# EAGLE design Cargador_RasPi3HAT_CamSlot_v1.0 (EAGLE 9.3.0)
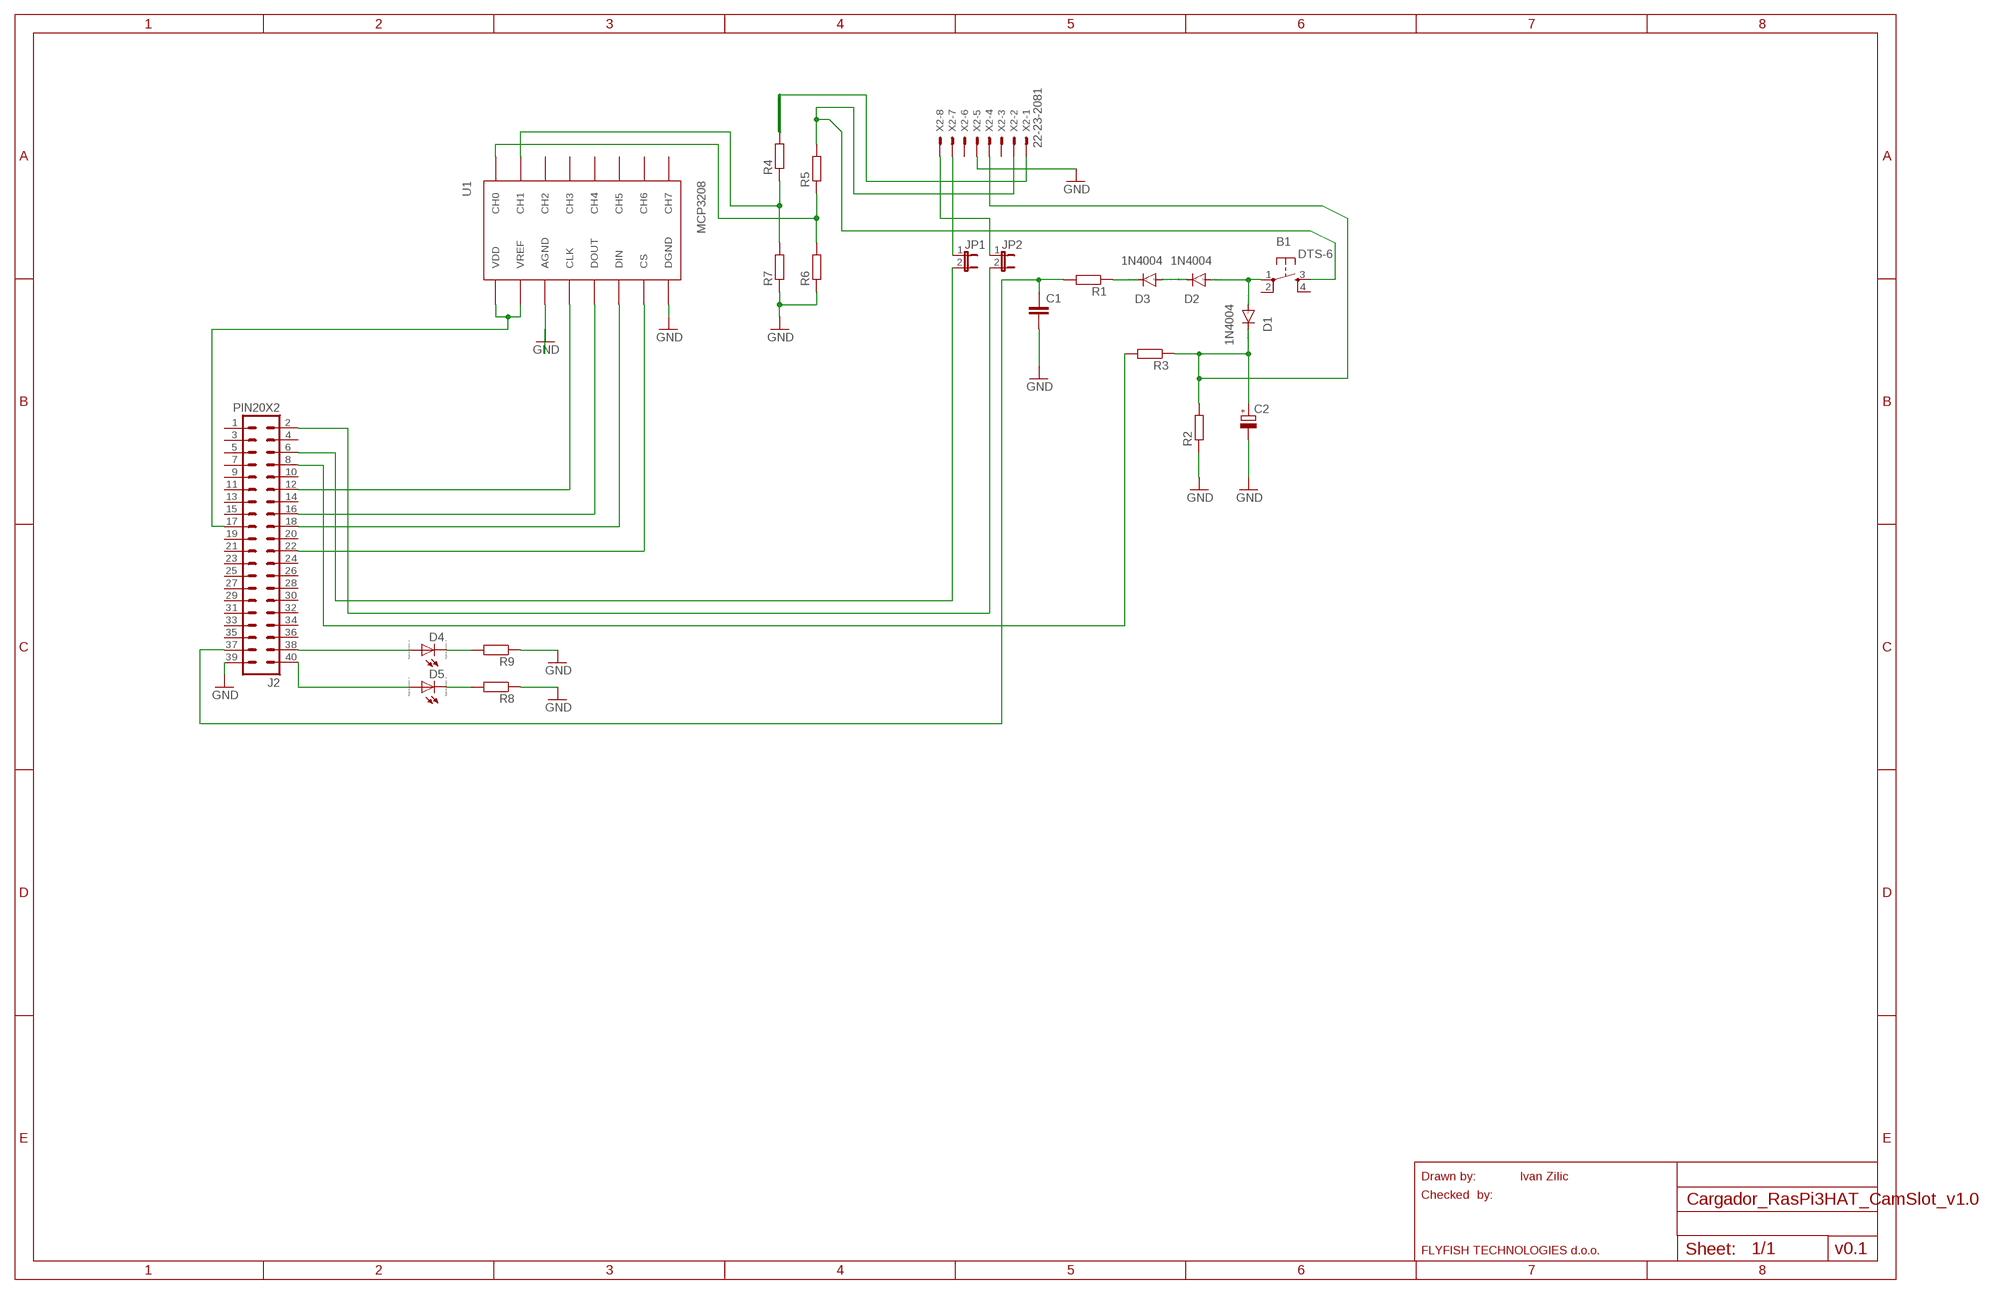
[diagram p0: schematic, sheet 1]

## Parts
B1  DTS-6  [DTS-6]
C1  C2.5/2  [C2.5-2]
C2  CPOL-EUE5-4  [E5-4]
D1  1N4004  [DO41-10]
D2  1N4004  [DO41-10]
D3  1N4004  [DO41-10]
D4  LED_ELD260  [LED_LD260]
D5  LED_ELD260  [LED_LD260]
J2  PIN20X2  [PIN_20X2]
JP1  JP1E  [JP1]
JP2  JP1E  [JP1]
R1  R-EU_0207/10  [0207/10]
R2  R-EU_0207/10  [0207/10]
R3  R-EU_0207/10  [0207/10]
R4  R-EU_0207/10  [0207/10]
R5  R-EU_0207/10  [0207/10]
R6  R-EU_0207/10  [0207/10]
R7  R-EU_0207/10  [0207/10]
R8  R-EU_0207/10  [0207/10]
R9  R-EU_0207/10  [0207/10]
U1  MCP3208  [DIL16]
X2  22-23-2081  [22-23-2081]

## Nets
GND [GND]: C1.2 C2.- J2.39 R2.1 R6.1 R7.1 R8.1 R9.1 U1.AGND U1.DGND X2.5
N$1: J2.6 JP1.2
N$2: J2.8 R3.2
N$3: D4.K(C) R9.2
N$4: D5.K(C) R8.2
N$5: D3.C R1.1
N$6: D5.A J2.40
N$7: D4.A J2.38
N$8: J2.22 U1.CS
N$9: J2.16 U1.DOUT
N$10: J2.18 U1.DIN
N$11 [GND]: J2.12 U1.CLK
N$12: J2.17 U1.VDD U1.VREF
N$13 [GND]: R4.1 R7.2 U1.CH1
N$14: R5.1 R6.2 U1.CH0
N$15: R4.2 X2.1
N$16 [GND]: B1.3 R5.2 X2.2
N$17: JP1.1 X2.7
N$19: JP2.1 X2.8
N$20: J2.2 JP2.2
N$21: C1.1 J2.37 R1.2
N$23: D2.C D3.A
N$24 [GND]: B1.1 D1.A D2.A
N$26 [GND]: C2.+ D1.C R2.2 R3.1 X2.4
Unconnected: B1.2 B1.4 J2.1 J2.3 J2.4 J2.5 J2.7 J2.9 J2.10 J2.11 J2.13 J2.14 J2.15 J2.19 J2.20 J2.21 J2.23 J2.24 J2.25 J2.26 J2.27 J2.28 J2.29 J2.30 J2.31 J2.32 J2.33 J2.34 J2.35 J2.36 U1.CH2 U1.CH3 U1.CH4 U1.CH5 U1.CH6 U1.CH7 X2.3 X2.6

## Notes on the sheet
- Drawn by: | Ivan Zilic
- Checked  by:
- FLYFISH TECHNOLOGIES d.o.o. | v0.1

## Library data of the parts
B1 = switch-tact:DTS-6
C1 = capacitor-wima:C: CAPACITOR naming: grid - package width
C2 = rcl:CPOL-EU: POLARIZED CAPACITOR, European symbol; SPICEPREFIX: C
D1-D3 = diode:1N4004: DIODE general purpose rectifier, 1 A
D4 D5 = eagle-ltspice:LED_E: LED Source: http://www.osram.convergy.de Source: www.luxeon.com Source: www.kingbright.com; SPICEMODEL: NONE; SPICEPREFIX: D; SPICETYPE: diode
J2 = FLYFISH:PIN20X2
JP1 JP2 = jumper:JP1E: JUMPER
R1-R9 = rcl:R-EU_: RESISTOR, European symbol; SPICEPREFIX: R
U1 = mcp3208:MCP3208
X2 = con-molex:22-23-2081: .100" (2.54mm) Center Header - 8 Pin; MF: MOLEX; MPN: 22-23-2081; OC_FARNELL: 1756826; OC_NEWARK: 01C7592

## Net classes
1 GND: width 0.254 mm, clearance 0.381 mm

## Board
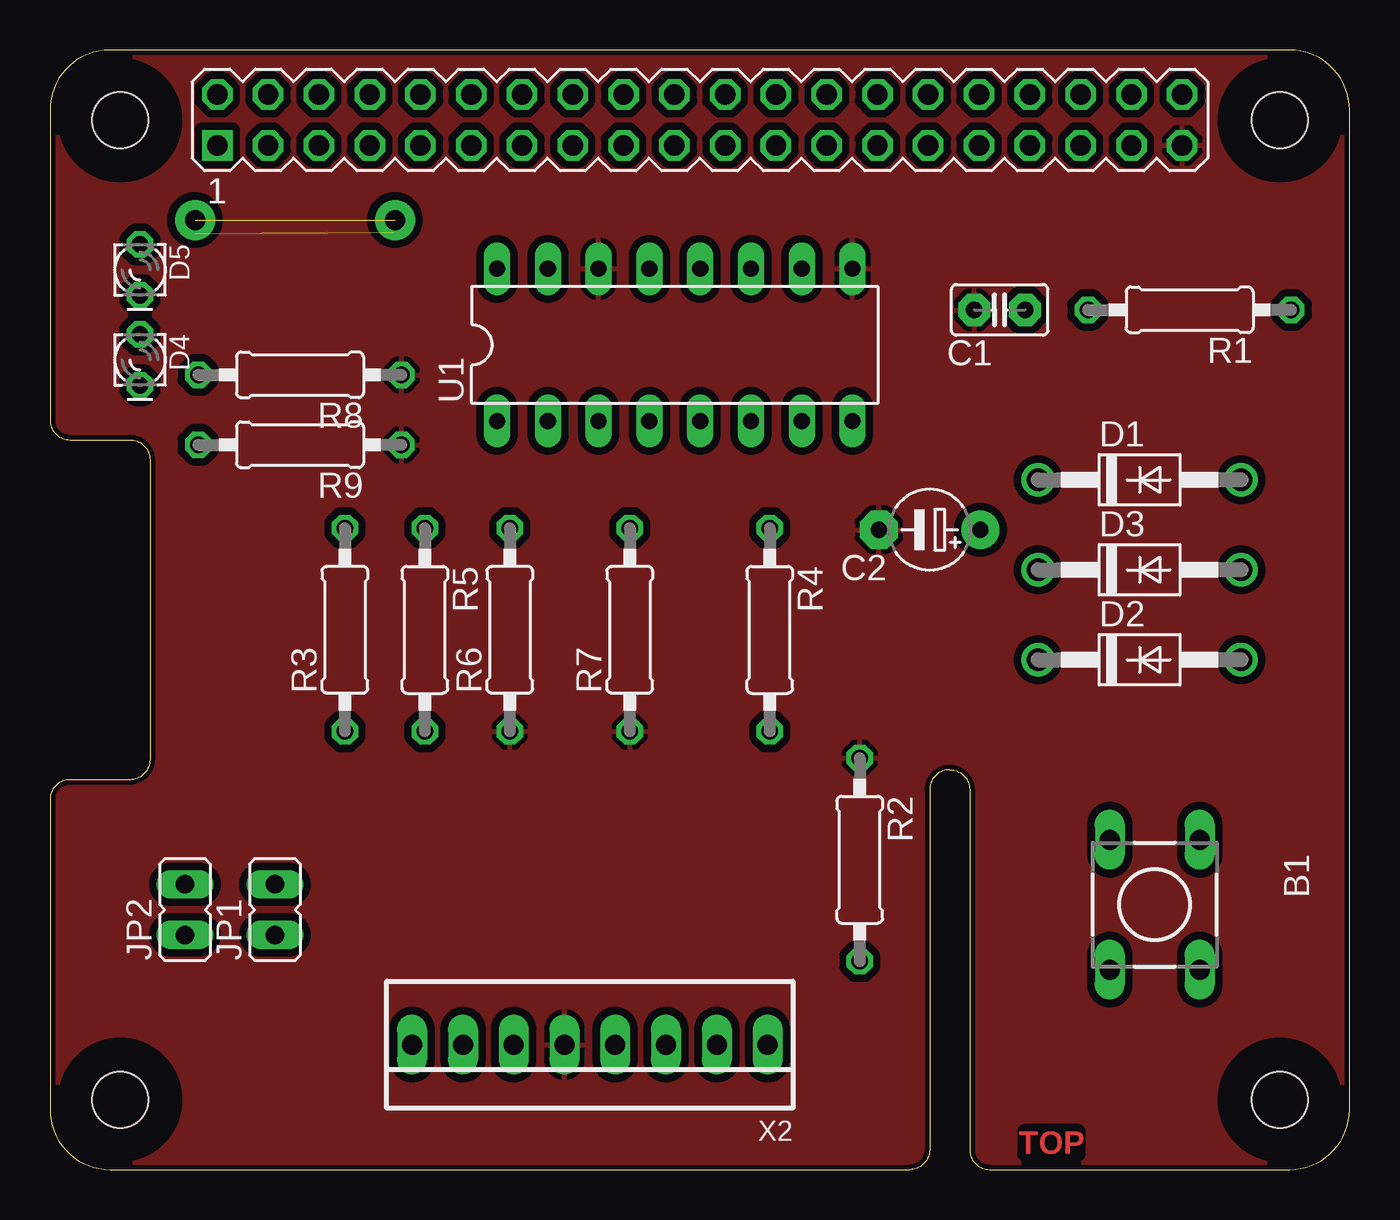
[diagram p1: board, top side]
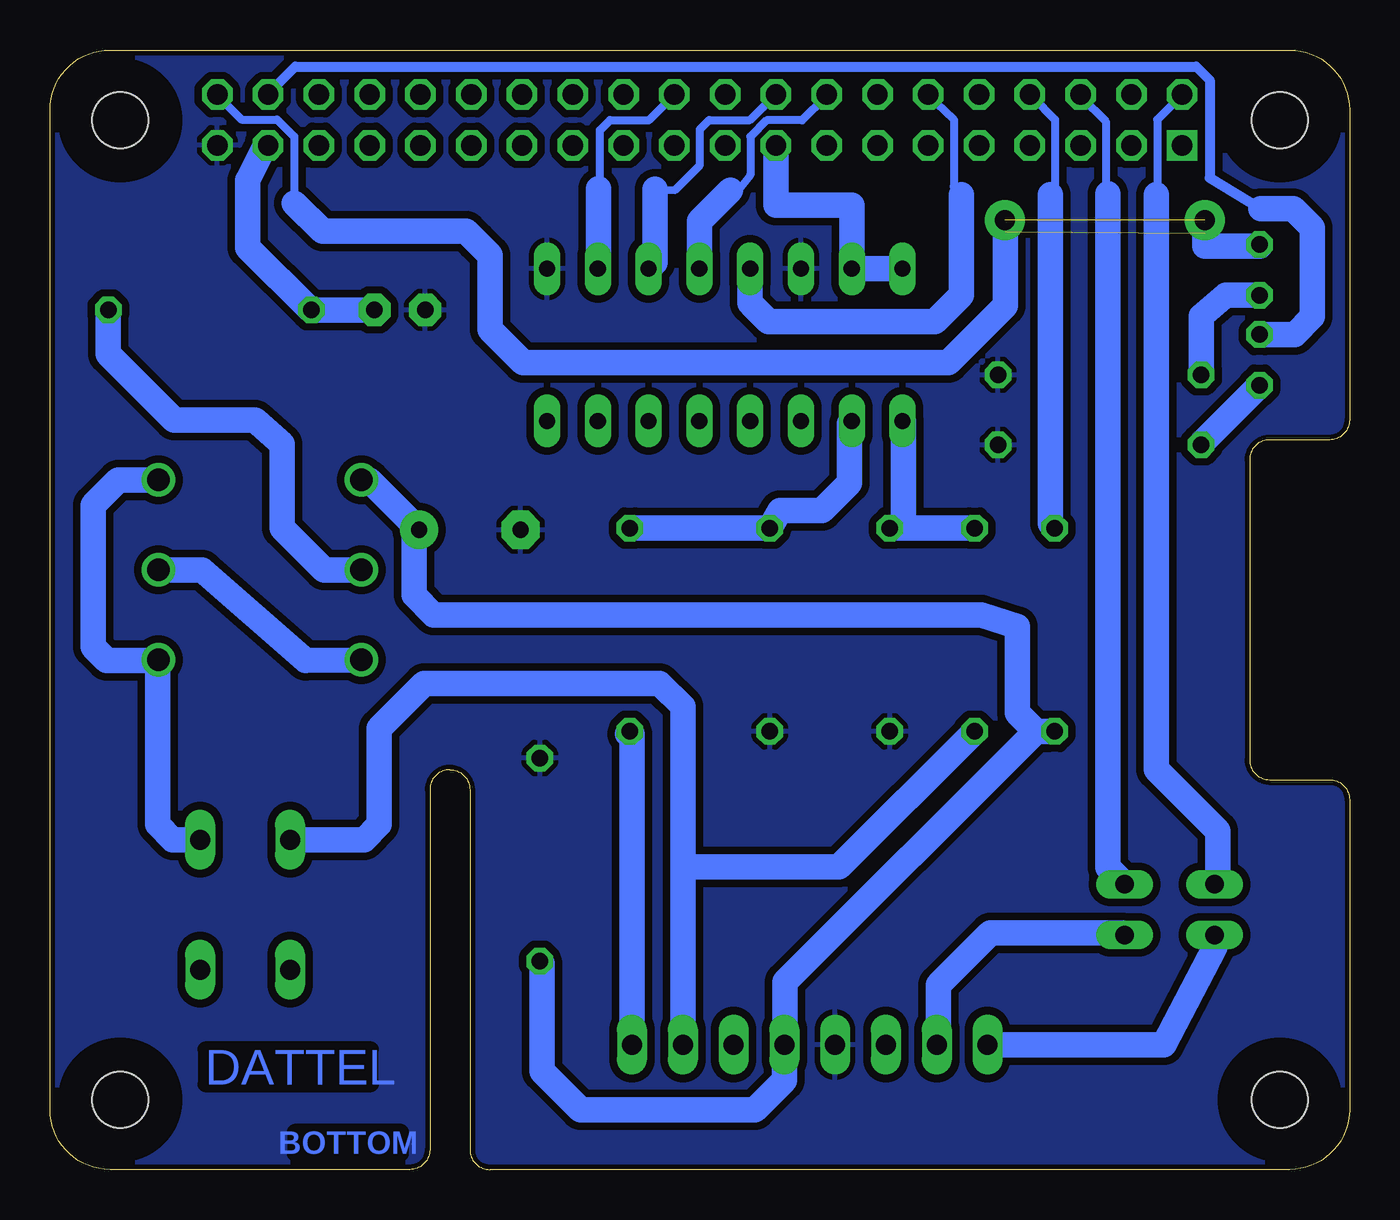
[diagram p2: board, bottom side, seen from below]

Size 65 x 56 mm. Coordinates in mm from the lower left corner, seen from the top.
Outline: 0,3 arc90 3,0 43,0 arc90 44,1 44,19 arc-90 45,20 arc-90 46,19 46,1 arc90 47,0 62,0 arc90 65,3 65,53 arc90 62,56 3,56 arc90 0,53 0,37.5 arc90 1,36.5 4,36.5 arc-90 5,35.5 5,20.5 arc-90 4,19.5 1,19.5 arc90 0,18.5 0,3
Copper layers (1*16): Top 0.035mm / dielectric 1.5mm / Bottom 0.035mm
Design rules "ITEADstudio_DRC": minimum track width 6mil, minimum drill 12mil, track to track 6mil, track to pad 6mil, pad to pad 6mil, via to via 6mil, smd to smd 0mil, copper to edge 10mil, drill to drill 10mil, minimum pad ring 10mil, minimum via ring 6mil, stop-mask expansion 2mil, vias tented up to drill 100mil, thermal gap 10mil
Holes 2.8 mm at 3.5,3.5 3.5,52.5 61.5,52.5 61.5,3.5
tRestrict: area 1.9,51 to 5,54; area 60,51 to 63,54; area 60,1.9 to 63,5; area 1.9,1.9 to 5,5
bRestrict: area 1.9,1.9 to 5,5; area 1.9,51 to 5,54; area 60,1.9 to 63,5; area 60,51 to 63,54

### Footprints (pad centres in the part's own frame; a part is rotated, then mirrored left to right if it is on the bottom)
DTS-6 = drill 1 long: 1 -3.25,2.25; 2 3.25,2.25; 3 -3.25,-2.25; 4 3.25,-2.25
C2.5-2 = drill 0.813 pad 1.6 octagon: 1 -1.27,0; 2 1.27,0
E5-4 = drill 0.813 pad 1.905: + -2.54,0 | drill 0.813 pad 1.905 octagon: - 2.54,0
DO41-10 = drill 1.118: A 5.08,0; C -5.08,0
LED_LD260 = drill 0.813 octagon: A -1.27,0; K 1.27,0
PIN_20X2 = drill 1.016 square: 1 -24.13,-1.27 | drill 1.016 octagon: 2 -24.13,1.27; 3 -21.59,-1.27; 4 -21.59,1.27; 5 -19.05,-1.27; 6 -19.05,1.27; 7 -16.51,-1.27; 8 -16.51,1.27; 9 -13.97,-1.27; 10 -13.97,1.27; 11 -11.43,-1.27; 12 -11.43,1.27; 13 -8.89,-1.27; 14 -8.89,1.27; 15 -6.35,-1.27; 16 -6.35,1.27; 17 -3.81,-1.27; 18 -3.81,1.27; 19 -1.27,-1.27; 20 -1.27,1.27; 21 1.27,-1.27; 22 1.27,1.27; 23 3.81,-1.27; 24 3.81,1.27; 25 6.35,-1.27; 26 6.35,1.27; 27 8.89,-1.27; 28 8.89,1.27; 29 11.43,-1.27; 30 11.43,1.27; 31 13.97,-1.27; 32 13.97,1.27; 33 16.51,-1.27; 34 16.51,1.27; 35 19.05,-1.27; 36 19.05,1.27; 37 21.59,-1.27; 38 21.59,1.27; 39 24.13,-1.27; 40 24.13,1.27
JP1 = drill 0.914 long: 1 0,-1.27; 2 0,1.27
0207/10 = drill 0.813 octagon: 1 -5.08,0; 2 5.08,0
DIL16 = drill 0.813 long: AGND -3.81,3.81; CH0 -8.89,-3.81; CH1 -6.35,-3.81; CH2 -3.81,-3.81; CH3 -1.27,-3.81; CH4 1.27,-3.81; CH5 3.81,-3.81; CH6 6.35,-3.81; CH7 8.89,-3.81; CLK -1.27,3.81; CS 6.35,3.81; DGND 8.89,3.81; DIN 3.81,3.81; DOUT 1.27,3.81; VDD -8.89,3.81; VREF -6.35,3.81
22-23-2081 = drill 1 long: 1 -8.89,0; 2 -6.35,0; 3 -3.81,0; 4 -1.27,0; 5 1.27,0; 6 3.81,0; 7 6.35,0; 8 8.89,0

### Placement (x,y rotation side)
B1  55.25,13.25 270 top
C1  47.5,43 180 top
C2  44,32 180 top
D1  54.5,34.5 0 top
D2  54.5,25.5 0 top
D3  54.5,30 0 top
D4  4.5,40.5 270 top
D5  4.5,45 270 top
J2  32.5,52.5 0 top
JP1  11.25,13 0 top
JP2  6.75,13 0 top
R1  57,43 180 top
R2  40.5,15.5 270 top
R3  14.75,27 90 top
R4  36,27 270 top
R5  18.75,27 270 top
R6  23,27 90 top
R7  29,27 90 top
R8  12.5,39.75 180 top
R9  12.5,36.25 180 top
U1  31.25,41.25 0 top
X2  27,6.25 180 top

### Tracks (layer width: path | path; a pad name or v marks a point on that pad's centre or on a via)
GND
  pour Bottom: 0,3 arc90 3,0 43,0 arc90 44,1 44,19 arc-90 45,20 arc-90 46,19 46,1 arc90 47,0 62,0 arc90 65,3 65,53 arc90 62,56 3,56 arc90 0,53 0,37.5 arc90 1,36.5 4,36.5 arc-90 5,35.5 5,20.5 arc-90 4,19.5 1,19.5 arc90 0,18.5
  pour Top: 0,3 arc90 3,0 43,0 arc90 44,1 44,19 arc-90 45,20 arc-90 46,19 46,1 arc90 47,0 62,0 arc90 65,3 65,53 arc90 62,56 3,56 arc90 0,53 0,37.5 arc90 1,36.5 4,36.5 arc-90 5,35.5 5,20.5 arc-90 4,19.5 1,19.5 arc90 0,18.5
  pour Bottom: -0.55,56.8 63.95,56.8 66.15,54.6 66.15,1.15 64.35,-0.65 1.2,-0.65 -1,1.55 -1,56.35
N$1
  Bottom 0.152: 12.19,48.72 12.09,48.82 | 13.41,53.65 J2.6
  Bottom 0.406: 12.19,48.72 12.19,52.43 13.41,53.65
  Bottom 1.27: 12.09,48.82 12.09,15.11 JP1.2
N$2
  Bottom 0.152: 14.73,49 14.97,48.75 | 15.85,53.65 J2.8
  Bottom 0.406: 14.73,49 14.73,52.52 15.85,53.65
  Bottom 1.27: 14.97,48.75 14.97,32.3 R3.2
N$3
  Bottom 1.27: D4.K 7.42,36.31 R9.2
N$4
  Bottom 1.27: R8.2 7.42,42.69 6.19,43.73 D5.K
N$5
  Bottom 1.27: D3.C 51.3,30 53.4,32.1 53.4,36.3 54.75,37.5 58.8,37.5 62.08,40.78 R1.1
N$6  (1 unrouted)
  Bottom 0.152: D5.A 4.5,46.18 | 56.54,53.65 J2.40
  Bottom 0.406: 52.78,48.35 52.78,51.66 53.65,52.52 55.42,52.52 56.54,53.65
  Bottom 1.27: 4.5,46.18 7.23,46.18 7.23,46.8 | 17.22,46.88 17.22,43.22 20.07,40.37 41.34,40.37 43,42.02 43,45.75 43.68,46.43 | 43.68,46.43 | 43.68,46.43 44.18,46.93 51.37,46.93 52.78,48.35
N$7
  Bottom 0.152: 54.1,53.8 J2.38 | 7.67,55.17
  Bottom 0.508: 4.43,48.05 7,49.6 7,54.5 7.67,55.17 52.73,55.17 54.1,53.8
  Bottom 1.27: D4.A 2.75,41.77 1.86,42.66 1.86,47.06 1.86,47.11 2.8,48.05 4.43,48.05
N$8
  Bottom 0.152: 37.55,49.05 37.5,48.94 | 35.02,52.52 35.02,52.5
  Bottom 0.406: 37.5,48.94 37.5,52 37,52.5 35.02,52.5 | 35.02,52.52 J2.22
  Bottom 1.27: 37.55,49.05 37.55,45.11 U1.CS
N$9
  Bottom 0.152: 30.55,49 30.97,49 | 26.21,53.65 J2.16
  Bottom 0.406: 30.55,49 29.97,49.75 29.97,51.66 29.15,52.48 27.38,52.48 26.21,53.65
  Bottom 1.27: 30.97,49 32.52,47.45 U1.DOUT
N$10
  Bottom 0.406: 34.75,49.03 33.75,49 32.5,50.25 32.5,52.03 32.03,52.5 30,52.5 29.33,53.13 J2.18
  Bottom 1.27: 34.75,49.03 34.75,45.37 U1.DIN
N$11
  Bottom 0.254: 19.8,49.16 19.41,48.77 | 29.98,43.33 29.9,43.25
  Bottom 0.406: J2.12 20.66,53.36 19.8,52.54 19.8,49.16
  Bottom 1.27: 29.9,43.25 29.07,42.42 20.73,42.42 19.41,43.74 19.41,48.77 | U1.CLK 29.98,43.33
N$12
  Bottom 1.27: J2.17 28.69,48.25 24.9,48.25 U1.VREF U1.VDD
N$13
  Bottom 1.27: U1.CH1 25.02,37.32 25.02,34.33 26.4,32.95 28.5,32.95 R7.2 R4.1
N$14
  Bottom 0.152: 22.31,37.44 U1.CH0
  Bottom 1.27: 22.31,32.08 R6.2 | 22.31,37.44 22.31,32.08 | R5.1 22.31,32.08
N$15
  Bottom 0.152: 36.12,21.79 R4.2
  Bottom 1.27: 36.12,21.79 36.01,21.9 35.89,21.78 X2.1
N$16
  Bottom 1.27: 33.34,15.14 25.53,15.14 R5.2 | 33.34,15.14 33.34,23.15 34.51,24.32 46.28,24.32 48.54,22.06 48.54,17.26 49.3,16.5 B1.3 | 33.34,15.14 33.34,8.26 33.35,8.25 X2.2
N$17
  Bottom 0.152: 20.57,6.26 X2.7
  Bottom 1.27: JP1.1 11.35,11.83 17.97,11.83 20.57,9.23 20.57,6.26
N$18  (via drill 1 pad 2)  (1 unrouted)
  other vias: 7.25,47.5 17.25,47.5
N$19
  Bottom 1.27: X2.8 9.3,6.25 6.75,11.12 JP2.1
N$20
  Bottom 0.152: JP2.2 6.58,14.44 | 9.66,48.77 9.62,48.81
  Bottom 0.406: J2.2 9.62,52.52 9.62,48.81
  Bottom 1.27: 6.58,14.44 6.58,16.94 9.66,20.01 9.66,48.77
N$21
  Bottom 0.152: 51.82,42.98 R1.2 51.97,42.98 | 48.83,42.98 C1.1
  Bottom 1.27: 48.83,42.98 51.82,42.98 | 51.97,42.98 55.1,46.11 55.1,49.5 54.36,50.96 J2.37
N$23
  Bottom 1.27: D3.A 57.38,30 52.2,25.47 D2.C
N$24
  Bottom 0.254: 59.61,25.47 D2.A
  Bottom 1.27: D1.A 61.58,34.5 62.83,33.25 62.83,26.13 62.17,25.47 59.61,25.47 59.61,17.26 58.85,16.5 B1.1
N$26
  Bottom 0.254: 28.24,9.38 28.24,9.28
  Bottom 1.27: D1.C 49.04,34.5 C2.+ 46.79,31.75 46.79,28.73 45.81,27.75 18.42,27.75 16.62,27.16 16.62,22.84 15.7,21.92 | R2.2 40.4,10.31 40.4,4.92 38.48,3 29.73,3 28.27,4.46 X2.4 28.24,6.28 28.24,9.28 | R3.1 15.7,21.92 | 15.7,21.92 28.24,9.38

### Text on the board
Top: TOP
Bottom: DATTEL | BOTTOM